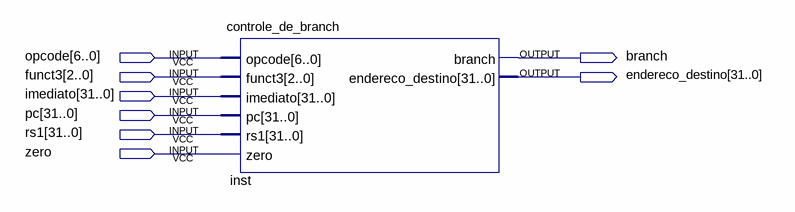
[diagram p0: schematic sheet]
// Quartus schematic teste_controle_de_branch.bdf as structural Verilog: 1 symbols, 8 pins
module teste_controle_de_branch (
  input  [6:0] opcode,
  input  [2:0] funct3,
  input  [31:0] imediato,
  input  [31:0] pc,
  input  [31:0] rs1,
  input  zero,
  output branch,
  output [31:0] endereco_destino
);

  controle_de_branch inst (
    .opcode(opcode), .funct3(funct3), .imediato(imediato), .pc(pc), .rs1(rs1), .zero(zero), .branch(branch),
    .endereco_destino(endereco_destino));
endmodule
